# Altium schematic sheet Mattruoc.SchDoc
size A4; Organization: Altium Limited; Address1: L3, 12a Rodborough Rd; Address2: Frenchs Forest; Address3: NSW; Address4: Australia 2086
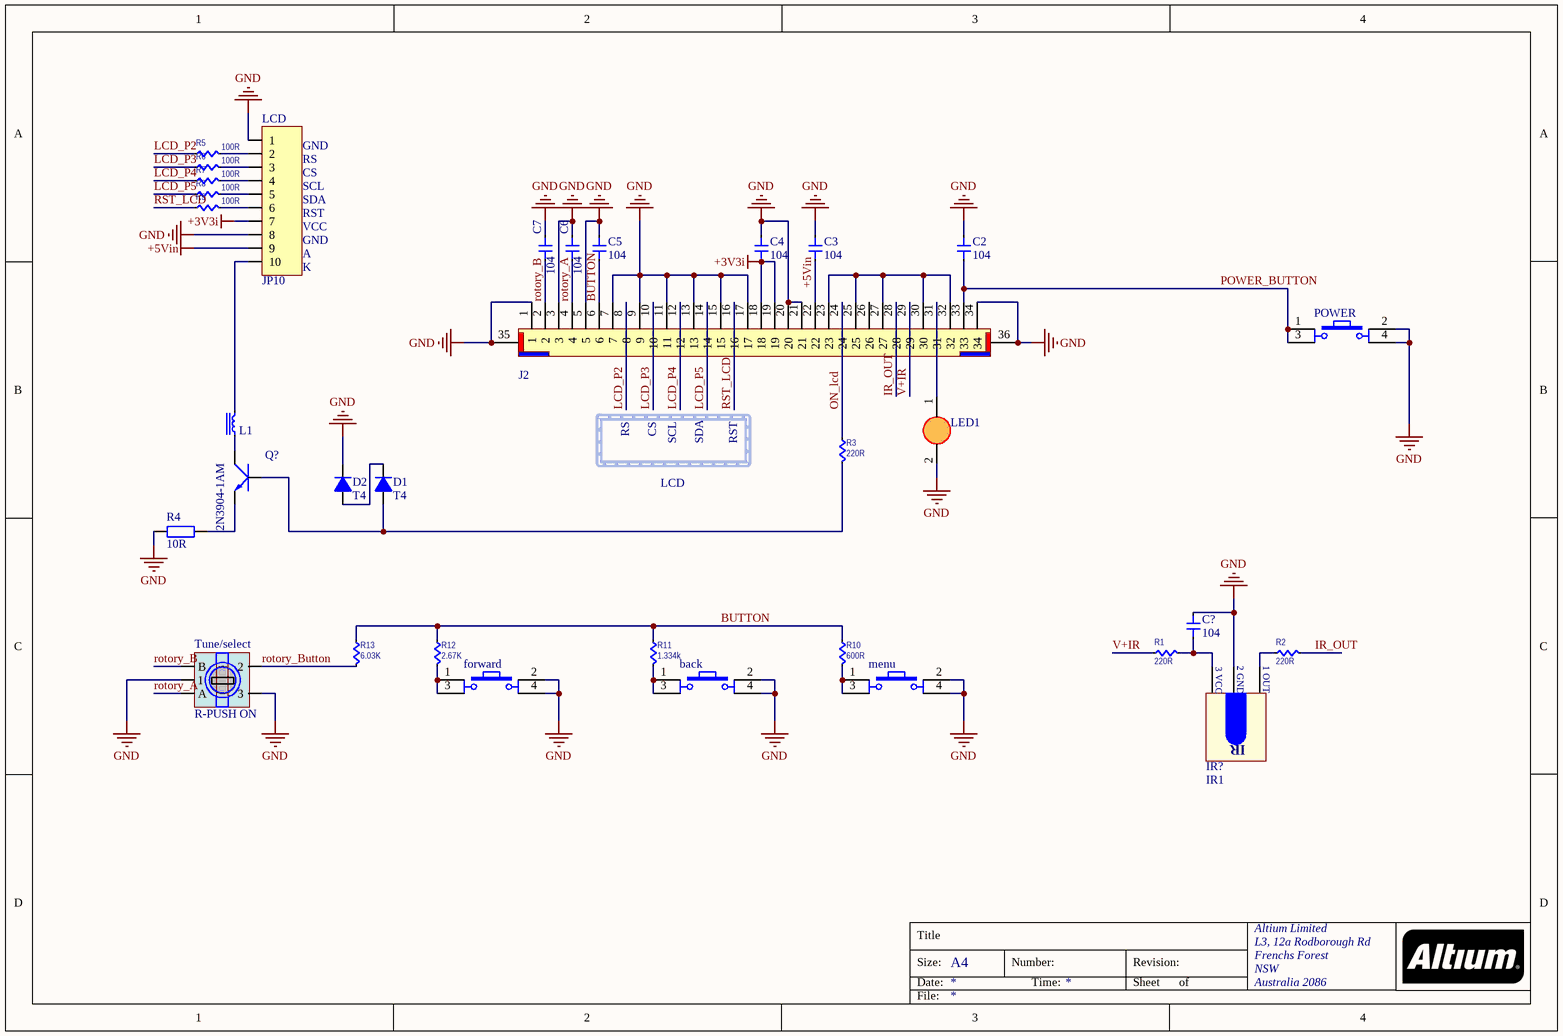
[diagram p0: Mattruoc.SchDoc]

## Parts
back  Nut Nhan 4 Chan  [SW4]  (value not drawn)
C2  104  [CAP 0402]
C3  104  [CAP 0402]
C4  104  [CAP 0402]
C5  104  [CAP 0402]
C6  104  [CAP 0402]
C7  104  [CAP 0402]
C?  104  [CAP 0402]
D1  T4  [Diode 1N4148]
D2  T4  [Diode 1N4148]
forward  Nut Nhan 4 Chan  [SW4]  (value not drawn)
IR?  IR1  [IR]
J2  0.5mm 34P H  [FPC-0.5MM-34P-H2.0]  (value not drawn)
L1  FERRITE BEAD 1 KOHM 0402 1LN  [IND 0402]  (value not drawn)
LCD  JP10  [JP10-D1T]
LED1  LED 3mm Do  [LED 3mm Do]  (value not drawn)
menu  Nut Nhan 4 Chan  [SW4]  (value not drawn)
POWER  Nut Nhan 4 Chan  [SW4]  (value not drawn)
Q?  2N3904-1AM  [SOT23BCE]
R1  220R  [RES 0402]
R2  220R  [RES 0402]
R3  220R  [RES 0402]
R4  10R  [tro smd 0805]
R5  100R  [RES 0402]
R6  100R  [RES 0402]
R7  100R  [RES 0402]
R8  100R  [RES 0402]
R9  100R  [RES 0402]
R10  600R  [RES 0402]
R11  1.334k  [RES 0402]
R12  2.67K  [RES 0402]
R13  6.03K  [RES 0402]
Tune/select  R-PUSH ON  [Rotory En po]

## Nets
+3V3i: C4.1 J2.18 J2.19 LCD.7
+5Vin: C3.1 J2.22 LCD.9
GND: back.2 back.4 C2.2 C3.2 C4.2 C5.2 C6.2 C7.2 C?.2 D2.2(K) forward.2 forward.4 IR?.2(GND) J2.1 J2.3 J2.5 J2.7 J2.9 J2.11 J2.13 J2.15 J2.17 J2.20 J2.21 J2.34 J2.35 J2.36 LCD.1 LCD.8 LED1.2(K) menu.2 menu.4 POWER.2 POWER.4 R4.2 Tune/select.1 Tune/select.3
BUTTON: C5.1 J2.6 R10.1 R11.1 R12.1 R13.1
IR_OUT: J2.28 R2.2
LCD_P2: J2.8 R5.1
LCD_P3: J2.10 R6.1
LCD_P4: J2.12 R7.1
LCD_P5: J2.14 R8.1
ON_lcd: J2.24 R3.1
POWER_BUTTON: C2.1 J2.33 POWER.1 POWER.3
rotory_A: C6.1 J2.4 Tune/select.A
rotory_B: C7.1 J2.2 Tune/select.B
rotory_Button: R13.2 Tune/select.2
RST_LCD: J2.16 R9.1
V+IR: J2.29 R1.1
Netback_1: back.1 back.3 R11.2
NetC?_1: C?.1 IR?.3(VCC) R1.2
NetD1_1: D1.1(A) Q?.1(B) R3.2
NetD1_2: D1.2(K) D2.1(A)
Netforward_1: forward.1 forward.3 R12.2
NetIR?_1: IR?.1(Out) R2.1
NetJ2_23: J2.23 J2.25 J2.27 J2.30 J2.32
NetJ2_31: J2.31 LED1.1(A)
NetL1_1: L1.1 Q?.2(C)
NetL1_2: L1.2 LCD.10
NetLCD_2: LCD.2 R5.2
NetLCD_3: LCD.3 R6.2
NetLCD_4: LCD.4 R7.2
NetLCD_5: LCD.5 R8.2
NetLCD_6: LCD.6 R9.2
Netmenu_1: menu.1 menu.3 R10.2
NetQ?_3: Q?.3(E) R4.1

Not connected (* = marked no-connect by the designer): J2 26

## Notes on the sheet
- (near LCD) CS
- (near LCD) GND
- (near LCD) RS
- (near LCD) VCC
- (near LCD) RST
- (near LCD) SDA
- (near LCD) SCL
- (near LCD) K
- (near LCD) A
- RS
- CS
- SCL
- SDA
- RST
- LCD
- Title
- Size:
- Date:
- A4
- Number:
- Time:
- Revision:
- Sheet
- of
- File:
- (in symbol IR1) 3 VCC; 2 GND; 1 OUT; IR

## Library data of the parts
back forward menu POWER = Nut Nhan 4 Chan: Cắm; Value: Nút Nhấn 4 Chân 6x6x9MM DIP; Ma_Hang: MH004077; Don_Vi: Con; Kieu Chan: *; Ghi Chu: *
C2-C7 C? = CAP CER 12pF 50V 0402: C1550; Manufacturer: Murata Electronics North America; Manufacturer Part Number: GRM1555C1H120JA01D; Tolerance: ±5%; Voltage - Rated: 50V; Temperature Coefficient: C0G, NP0; Notification: Current market demand for these product types have resulted in fluctuating and extending lead times. Lead times may differ.; Supplier 1: Digi-Key; Supplier Part Number 1: 490-5924-1-ND; RoHS: RoHS Compliant; Category: Capacitors; Stock: 100000; Pricing: 1=0.1, 10=0.036, 100=0.0162, 500=0.0116, 1000=0.00911, 2500=0.00828, 5000=0.00762 (USD); Packaging: Cut Tape (CT); Part Status: Not For New Designs; Operating Temperature: -55°C ~ 125°C; Features: -; Ratings: -; Applications: General Purpose; Mounting Type: Surface Mount, MLCC; Package / Case: 0402 (1005 Metric); Size / Dimension: 0.039" L x 0.020" W (1.00mm x 0.50mm); Height - Seated (Max): -; Thickness (Max): 0.022" (0.55mm); Lead Spacing: -; Lead Style: -; ComponentLink1URL: https://www.murata.com/~/media/webrenewal/support/library/catalog/products/capacitor/mlcc/c02e.ashx?la=en-us; ComponentLink1Description: https://www.murata.com/~/media/webrenewal/support/library/catalog/products/capacitor/mlcc/c02e.ashx?la=en-us
D1 D2 = Diode 1N4148: Cắm; Ten_Linh_Kien: Diode 1N4148 DO35 450mA 100V ( 1N4148 DIP); Don_Vi: Con; Ma_Hang: MH001065; Ghi Chu: *; Kieu_Chan: *; Chung_Loai: Cắm
IR? = IR1: Receiver Infraed IC
J2 = CON FPC/FFC 0.5mm 34P horizontal: Manufacturer Part Number: CON FPC/FFC 0.5mm 18P VERTICAL; Manufacturer: CHINA
L1 = FB SMD 0402: C76882 Extend; Manufacturer: Murata Electronics North America; Manufacturer Part Number: BLM15AG102SN1D; Number of Lines: 1; Impedance @ Frequency: 1 kOhm @ 100MHz; Current Rating (Max): 300mA; DC Resistance (DCR) (Max): 650 mOhm; Supplier 1: Digi-Key; RoHS: RoHS Compliant; Category: Filters; Stock 1: 162881; Pricing 1: 1=0.1, 10=0.084, 50=0.0688, 100=0.0505, 250=0.03668, 500=0.03364, 1000=0.02905, 5000=0.02294 (USD); Packaging: Cut Tape (CT); Part Status: Active; Filter Type: -; Ratings: -; Operating Temperature: -55°C ~ 125°C; Package / Case: 0402 (1005 Metric); Mounting Type: Surface Mount; Height (Max): 0.022" (0.55mm); Size / Dimension: 0.039" L x 0.020" W (1.00mm x 0.50mm); ComponentLink1URL: http://search.murata.co.jp/Ceramy/image/img/PDF/ENG/L0110S0100BLM15AG_SN.pdf; ComponentLink1Description: http://search.murata.co.jp/Ceramy/image/img/PDF/ENG/L0110S0100BLM15AG_SN.pdf; Supplier Part Number 1: 490-1007-1-ND
LCD = JP10: ST7789 10pin LCD; Manufacturer: W¨¹rth Elektronik eiSos GmbH; partNo: 613010143121; ComponentLink1 Description: Manufacturer; ComponentLink2 Description: Datasheet; NoPins: 10; Created Date: 29 March 2013; ComponentLink1URL: http://www.we-online.com; ComponentLink2URL: http://katalog.we-online.de/em/datasheet/6130xx143121.pdf; Created by: Karrer Zheng
LED1 = LED 3mm Do: Cắm; Ten_Linh_Kien: LED 3MM Sáng Đỏ ( SS); Ma_Hang: MH004931; Don_Vi: Con; Ghi_Chu: *; Kieu_Chan: *; Chung_Loai: Cắm
Q? = TRANS NPN: NPN; MMBTA42: 300V-NPN
R1-R3 R5-R13 = RES 10K 0402 1%: RES SMD 10K OHM 1% 1/16W 0402; Manufacturer: Vishay Dale; Manufacturer Part Number: CRCW040210K0FKED; Power (Watts): 0.063W, 1/16W; Temperature Coefficient: ±100ppm/°C; Supplier 1: Digi-Key; RoHS: RoHS Compliant; Category: Resistors; Stock 1: 2392462; Pricing 1: 10=0.083, 50=0.0444, 200=0.0255, 1000=0.0174 (USD); Packaging: Cut Tape (CT); Resistance (Ohms): 10k; Tolerance: ±1%; Composition: Thick Film; Features: Automotive AEC-Q200; Operating Temperature: -55°C ~ 155°C; Package / Case: 0402 (1005 Metric); Supplier Device Package: 0402 (1005 Metric); Size / Dimension: 0.039" L x 0.020" W (1.00mm x 0.50mm); Height: 0.016" (0.40mm); Number of Terminations: 2; ComponentLink1URL: http://www.vishay.com/docs/20035/dcrcwe3.pdf; ComponentLink1Description: http://www.vishay.com/docs/20035/dcrcwe3.pdf; Supplier Part Number 1: 541-10.0KLCT-ND
R4 = Tro 0805 1% 0.22R: Dán; Don_Vi: Con; So_Chan: 2; Ten_Linh_Kien: Trở 0805 1% 0.22R; Ma_Hang: MH005466; Chung_Loai: Dán; Kieu_Chan: *
Tune/select = Rotary Encoder: Cắm; Chung_Loai: Cắm